# Altium schematic sheet Additional Feature.SchDoc: Team Additional Feature
size 431 x 279 mm; DocumentNumber: BMC-125-5321; Revision: A; SheetNumber: 6; SheetTotal: 6
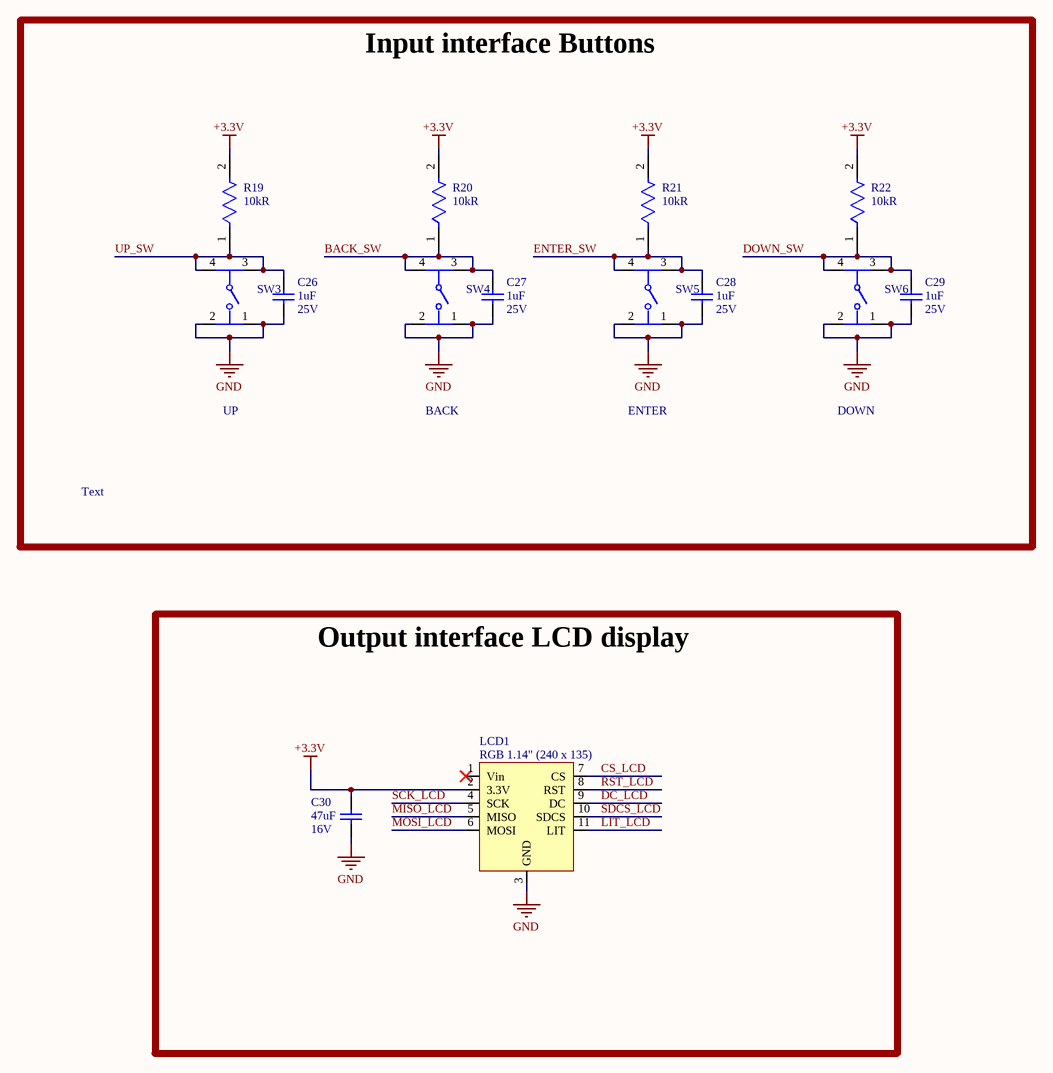
[diagram p0: Additional Feature.SchDoc]

## Parts
C26  value 1uF  Rated DC Voltage (URdc): 25V  [FP-CC0603-DA-IPC_B]  (hidden comment: 1uF 25V 0603)
C27  value 1uF  Rated DC Voltage (URdc): 25V  [FP-CC0603-DA-IPC_B]  (hidden comment: 1uF 25V 0603)
C28  value 1uF  Rated DC Voltage (URdc): 25V  [FP-CC0603-DA-IPC_B]  (hidden comment: 1uF 25V 0603)
C29  value 1uF  Rated DC Voltage (URdc): 25V  [FP-CC0603-DA-IPC_B]  (hidden comment: 1uF 25V 0603)
C30  value 47uF  Rated DC Voltage (URdc): 16V  [FP-1210-L_3_2_0_3-W_2_5_0-MFG]  (hidden comment: CAP)
LCD1  RGB 1.14" (240 x 135)  [PCBComponent_1]
R19  value 10kR  [RESC1608X55X25ML10T15]  (hidden comment: 10KOhm 0603)
R20  value 10kR  [RESC1608X55X25ML10T15]  (hidden comment: 10KOhm 0603)
R21  value 10kR  [RESC1608X55X25ML10T15]  (hidden comment: 10KOhm 0603)
R22  value 10kR  [RESC1608X55X25ML10T15]  (hidden comment: 10KOhm 0603)
SW3  PTS645SM43SMTR92LFS  [FP-PTS645SM43SMTR92LFS-MFG]  (value not drawn)
SW4  PTS645SM43SMTR92LFS  [FP-PTS645SM43SMTR92LFS-MFG]  (value not drawn)
SW5  PTS645SM43SMTR92LFS  [FP-PTS645SM43SMTR92LFS-MFG]  (value not drawn)
SW6  PTS645SM43SMTR92LFS  [FP-PTS645SM43SMTR92LFS-MFG]  (value not drawn)

## Blocks framed on the sheet
Input interface Buttons: C26-C29 R19-R22 SW3-SW6
Output interface LCD display: C30 LCD1

## Nets
+3.3V: C30.2 LCD1.2(3.3V) R19.2 R20.2 R21.2 R22.2
GND: C26.1 C27.1 C28.1 C29.1 C30.1 LCD1.3(GND) SW3.1 SW3.2 SW4.1 SW4.2 SW5.1 SW5.2 SW6.1 SW6.2
BACK_SW: C27.2 R20.1 SW4.3 SW4.4
CS_LCD: LCD1.7(CS)
DC_LCD: LCD1.9(DC)
DOWN_SW: C29.2 R22.1 SW6.3 SW6.4
ENTER_SW: C28.2 R21.1 SW5.3 SW5.4
LIT_LCD: LCD1.11(LIT)
MISO_LCD: LCD1.5(MISO)
MOSI_LCD: LCD1.6(MOSI)
RST_LCD: LCD1.8(RST)
SCK_LCD: LCD1.4(SCK)
SDCS_LCD: LCD1.10(SDCS)
UP_SW: C26.2 R19.1 SW3.3 SW3.4

Not connected (* = marked no-connect by the designer): LCD1 1(Vin)*

## Notes on the sheet
- UP
- BACK
- ENTER
- DOWN
- Text
- 4
- 3
- DWG NO.
- REV
- 2
- 1
- ALL INFORMATION IN THIS DRAWING IS THE PROPERTY OF EMAC, AND CANNOT BE COPIED OR USED WITHOUT THE WRITTEN APPROVAL OF EMAC.
- D
- C
- B
- 2025 Bright Manufacturing Challenge
- SCHEMATIC
- A
- SIZE
- CODE IDENT
- 0BJZ8
- NONE
- SCALE
- WEIGHT
- NA
- SHEET
- OF
- REV. A, 06/21/2025
- FORM #PDE-0001-0001

## Library data of the parts
C26-C29 = CMP-00002-5: Ceramic Capacitor, Multilayer, Ceramic, 25V, 10% +Tol, 10% -Tol, X5R, 15% TC, 1uF, Surface Mount, 0603; Multilayer: Yes; Height: 0.8mm; Capacitor Type: Ceramic; Case/Package: 0603; Dielectric Material: Ceramic; JESD-609 Code: e3; Length: 1.6mm; Max Operating Temperature: 85°C; Min Operating Temperature: -55°C; Mounting Technology: Surface Mount; Package Shape: Rectangular; Package Style: SMTMeter; Packaging: Tape and Reel; Pins: 2; Reach SVHC Compliant: Yes; RoHS Compliant: Yes; Temperature Characteristics Code: X5R; Terminal Finish: Nickel; Termination: Wraparound; Tolerance  (fill in as +-): 10%; Tolerance (fill in as +-): 10%; Width: 0.8mm; Voltage Rating: 25V
C30 = CMP-00003-4: Ceramic Capacitor, Multilayer, Ceramic, 16V, 20% +Tol, 20% -Tol, X5R, 15% TC, 47uF, Surface Mount, 1210; Multilayer: Yes; Capacitor Type: Ceramic; Case/Package: 1210; Dielectric Material: Ceramic; Height: 2.5mm; JESD-609 Code: e3; Length: 3.2mm; Max Operating Temperature: 85°C; Min Operating Temperature: -55°C; Mounting Technology: Surface Mount; Package Shape: Rectangular; Package Style: SMTMeter; Packaging: Tape and Reel; Pins: 2; Reach SVHC Compliant: Yes; RoHS Compliant: Yes; Temperature Characteristics Code: X5R; Terminal Finish: Nickel; Termination: Wraparound; Tolerance  (fill in as +-): 20%; Tolerance (fill in as +-): 20%; Voltage Rating: 16V; Width: 2.5mm
LCD1 = RGB 1.14" (240 x 135): GRAPHIC DISPLAY TFT RGB 1.14"; Manufacturer: Adafruit Industries LLC; Manufacturer Part Number: 4383; Display Type: TFT - Color; Screen Size: 1.14" (28.96mm); Dot Pixel: 240 x 135; Dot Pixels: 240 x 135; Supplier 1: Digikey; Supplier Part Number 1: 1528-4383-ND
R19-R22 = CMP-00018-1: Fixed Resistor, Metal Glaze/thick Film, 0.1W, 10000ohm, 75V, 5% +/-Tol, 100ppm/Cel, Surface Mount, 0603; Additional Feature: LASER TRIMMABLE; Package Height: 0.45mm; Package Length: 1.6mm; Package Width: 0.8mm; Power: 100mW; Rated Temperature: 70°C; Temperature Coefficient (ppm/Cel): 100; Packaging: Tape and Reel; Tolerance: 5%; Case/Package: 0603; Construction: Chip; JESD-609 Code: e3; Max Operating Temperature: 155°C; Min Operating Temperature: -55°C; Mounting Technology: Surface Mount; Package Shape: Rectangular; Pins: 2; Reach SVHC Compliant: Yes; Resistor Type: FIXED RESISTOR; RoHS Compliant: Yes; Technology: METAL GLAZE/THICK FILM; Terminal Finish: Nickel; Termination: Wraparound; Working Voltage: 75V
SW3-SW6 = CMP-00020-2: Keypad Switch, 1 Switches, SPST, Momentary-tactile, 0.05A, 12VDC, 1.57N, 4 PCB Hole Cnt, Solder Terminal, Surface Mount-straight; Contact Resistance: 0.1mR; Actuator Type: Pushbutton; Body Breadth: 5.9944mm; Body Height: 3.4544mm; Contact Current(DC)-Max: 50mA; Contact DC Max Rating R Load: 0.05A@12VDC; Contact Voltage(DC)-Max: 12V; Dielectric Withstand Volts: 250VACV; Insulation Resistance: 100GR; PCB Hole Count: 4; Min Operating Temperature: -20°C; Termination: Solder; Switch Function: SPST; Max Operating Temperature: 60°C; Body Length or Diameter: 5.9944mm; JESD-609 Code: e4; Mounting Technology: Surface Mount; Reach SVHC Compliant: Yes; RoHS Compliant: Yes; Switch Action: MOMENTARY; Switch Type: Keypad; Terminal Finish: Silver; Terminal Length: 0.138inch